# EAGLE schematic Outline (EAGLE 6.6.0)
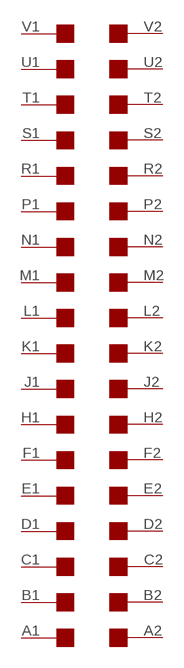
[diagram p0: schematic, sheet 1]

## Parts
U$2  EDGE-2ECONO  [ECONOSINGLE]
Unconnected: U$2.A1 U$2.A2 U$2.B1 U$2.B2 U$2.C1 U$2.C2 U$2.D1 U$2.D2 U$2.E1 U$2.E2 U$2.F1 U$2.F2 U$2.H1 U$2.H2 U$2.J1 U$2.J2 U$2.K1 U$2.K2 U$2.L1 U$2.L2 U$2.M1 U$2.M2 U$2.N1 U$2.N2 U$2.P1 U$2.P2 U$2.R1 U$2.R2 U$2.S1 U$2.S2 U$2.T1 U$2.T2 U$2.U1 U$2.U2 U$2.V1 U$2.V2

## Library data of the parts
U$2 = dec-con:EDGE-2: Double-Sided DEC edge connector.

## Net classes
0 default: width 0.508 mm